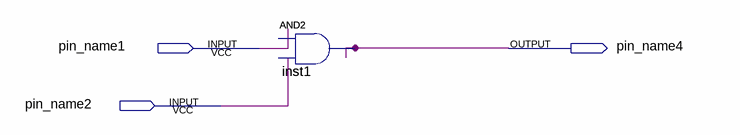
[diagram p0: schematic sheet]
// Quartus schematic Block1.bdf as structural Verilog: 2 symbols, 3 pins
module Block1 (
  input  pin_name1,
  input  pin_name2,
  output pin_name4
);

  wire undriven, undriven_2;

  and inst (pin_name4, undriven, undriven_2);
  and inst1 (pin_name4, undriven, undriven_2);
endmodule
